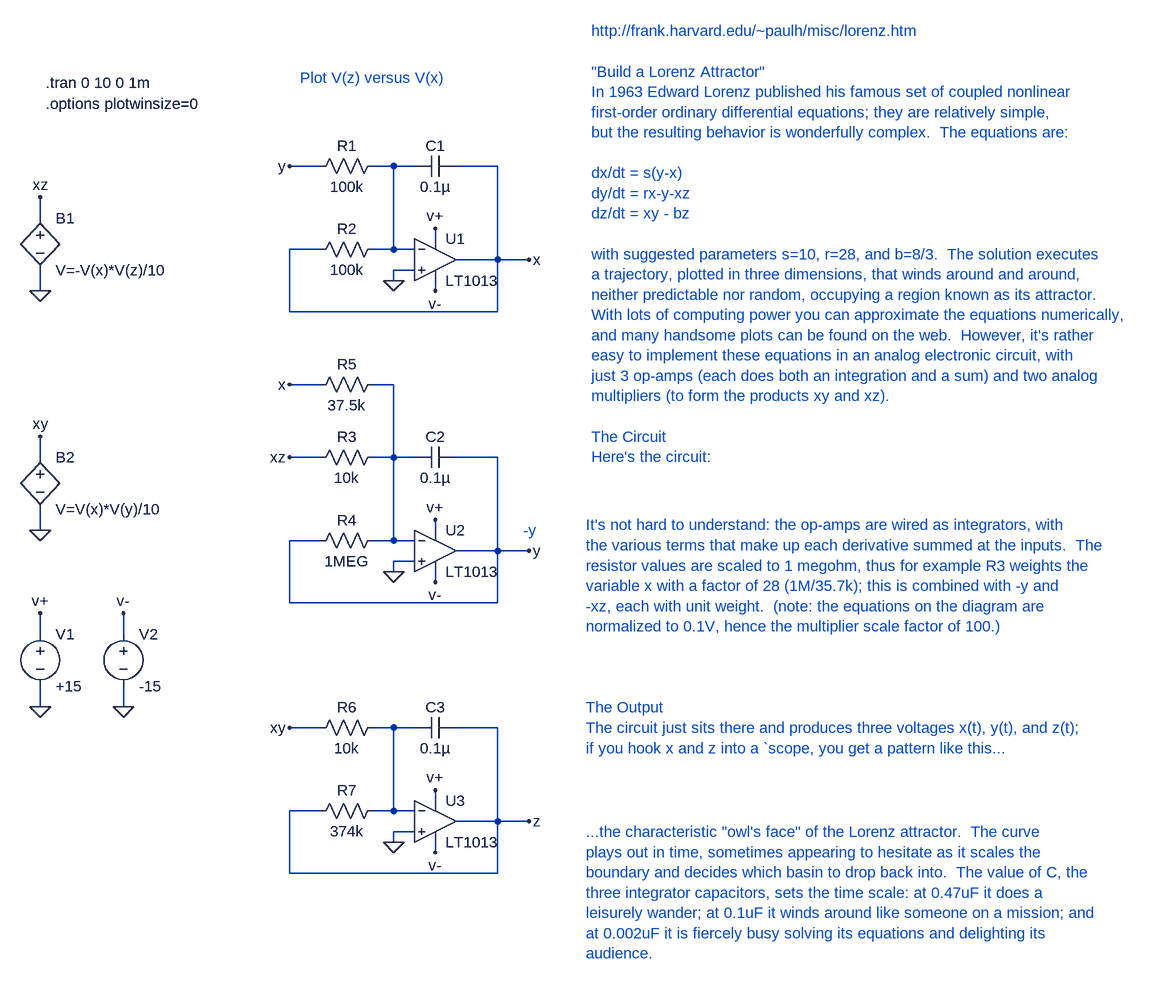
[diagram p0: schematic Lorenz.asc]
Lorenz.asc, the LTspice schematic file:
Version 4
SHEET 1 1476 884
WIRE 272 -368 240 -368
WIRE 240 -368 240 -240
WIRE 240 -368 208 -368
WIRE 240 -240 272 -240
WIRE 240 -240 208 -240
WIRE 336 -368 400 -368
WIRE 400 -368 400 -224
WIRE 400 -224 336 -224
WIRE 400 -224 448 -224
WIRE 272 -208 240 -208
WIRE 240 -208 240 -192
WIRE 304 -256 304 -272
WIRE 304 -192 304 -176
WIRE 400 -224 400 -144
WIRE 400 -144 80 -144
WIRE 80 -144 80 -240
WIRE 80 -240 128 -240
WIRE 128 -368 80 -368
WIRE 272 80 240 80
WIRE 240 80 240 208
WIRE 240 80 208 80
WIRE 240 208 272 208
WIRE 240 208 208 208
WIRE 336 80 400 80
WIRE 400 80 400 224
WIRE 400 224 336 224
WIRE 400 224 448 224
WIRE 272 240 240 240
WIRE 240 240 240 256
WIRE 304 192 304 176
WIRE 304 256 304 272
WIRE 400 224 400 304
WIRE 400 304 80 304
WIRE 80 304 80 208
WIRE 80 208 128 208
WIRE 128 80 80 80
WIRE 240 -32 208 -32
WIRE 128 -32 80 -32
WIRE 240 80 240 -32
WIRE 272 496 240 496
WIRE 240 496 240 624
WIRE 240 496 208 496
WIRE 240 624 272 624
WIRE 240 624 208 624
WIRE 336 496 400 496
WIRE 400 496 400 640
WIRE 400 640 336 640
WIRE 400 640 448 640
WIRE 272 656 240 656
WIRE 240 656 240 672
WIRE 304 608 304 592
WIRE 304 672 304 688
WIRE 400 640 400 720
WIRE 400 720 80 720
WIRE 80 720 80 624
WIRE 80 624 128 624
WIRE 128 496 80 496
WIRE -304 -208 -304 -176
WIRE -304 160 -304 192
WIRE -304 80 -304 48
WIRE -304 -288 -304 -320
WIRE -304 432 -304 464
WIRE -176 432 -176 464
WIRE -304 352 -304 320
WIRE -176 352 -176 320
FLAG 240 -192 0
FLAG 304 -272 v+
FLAG 304 -176 v-
FLAG 240 256 0
FLAG 304 176 v+
FLAG 304 272 v-
FLAG 240 672 0
FLAG 304 592 v+
FLAG 304 688 v-
FLAG 448 -224 x
FLAG 448 224 y
FLAG 448 640 z
FLAG 80 -368 y
FLAG 80 -32 x
FLAG 80 80 xz
FLAG 80 496 xy
FLAG -304 -176 0
FLAG -304 192 0
FLAG -304 -320 xz
FLAG -304 48 xy
FLAG -304 464 0
FLAG -176 464 0
FLAG -304 320 v+
FLAG -176 320 v-
SYMBOL Opamps\\LT1013 304 -288 R0
SYMATTR InstName U1
SYMBOL cap 272 -352 R270
WINDOW 0 32 32 VTop 0
WINDOW 3 0 32 VBottom 0
SYMATTR InstName C1
SYMATTR Value 0.1µ
SYMATTR SpiceLine IC=0
SYMBOL res 112 -352 R270
WINDOW 0 32 56 VTop 0
WINDOW 3 0 56 VBottom 0
SYMATTR InstName R1
SYMATTR Value 100k
SYMBOL res 112 -224 R270
WINDOW 0 32 56 VTop 0
WINDOW 3 0 56 VBottom 0
SYMATTR InstName R2
SYMATTR Value 100k
SYMBOL Opamps\\LT1013 304 160 R0
SYMATTR InstName U2
SYMBOL cap 272 96 R270
WINDOW 0 32 32 VTop 0
WINDOW 3 0 32 VBottom 0
SYMATTR InstName C2
SYMATTR Value 0.1µ
SYMATTR SpiceLine IC=0
SYMBOL res 112 96 R270
WINDOW 0 32 56 VTop 0
WINDOW 3 0 56 VBottom 0
SYMATTR InstName R3
SYMATTR Value 10k
SYMBOL res 112 224 R270
WINDOW 0 32 56 VTop 0
WINDOW 3 0 56 VBottom 0
SYMATTR InstName R4
SYMATTR Value 1MEG
SYMBOL res 112 -16 R270
WINDOW 0 32 56 VTop 0
WINDOW 3 0 56 VBottom 0
SYMATTR InstName R5
SYMATTR Value 37.5k
SYMBOL Opamps\\LT1013 304 576 R0
SYMATTR InstName U3
SYMBOL cap 272 512 R270
WINDOW 0 32 32 VTop 0
WINDOW 3 0 32 VBottom 0
SYMATTR InstName C3
SYMATTR Value 0.1µ
SYMATTR SpiceLine IC=0
SYMBOL res 112 512 R270
WINDOW 0 32 56 VTop 0
WINDOW 3 0 56 VBottom 0
SYMATTR InstName R6
SYMATTR Value 10k
SYMBOL res 112 640 R270
WINDOW 0 32 56 VTop 0
WINDOW 3 0 56 VBottom 0
SYMATTR InstName R7
SYMATTR Value 374k
SYMBOL bv -304 -304 R0
SYMATTR InstName B1
SYMATTR Value V=-V(x)*V(z)/10
SYMBOL bv -304 64 R0
SYMATTR InstName B2
SYMATTR Value V=V(x)*V(y)/10
SYMBOL voltage -304 336 R0
SYMATTR InstName V1
SYMATTR Value +15
SYMBOL voltage -176 336 R0
SYMATTR InstName V2
SYMATTR Value -15
TEXT 440 192 Left 0 ;-y
TEXT -296 -496 Left 0 !.tran 0 10 0 1m
TEXT -296 -464 Left 0 !.options plotwinsize=0
TEXT 544 -576 Left 0 ;http://frank.harvard.edu/~paulh/misc/lorenz.htm\n \n"Build a Lorenz Attractor"\nIn 1963 Edward Lorenz published his famous set of coupled nonlinear\nfirst-order ordinary differential equations; they are relatively simple,\nbut the resulting behavior is wonderfully complex.  The equations are:\n \ndx/dt = s(y-x)\ndy/dt = rx-y-xz\ndz/dt = xy - bz\n \nwith suggested parameters s=10, r=28, and b=8/3.  The solution executes\na trajectory, plotted in three dimensions, that winds around and around,\nneither predictable nor random, occupying a region known as its attractor.\nWith lots of computing power you can approximate the equations numerically,\nand many handsome plots can be found on the web.  However, it's rather\neasy to implement these equations in an analog electronic circuit, with\njust 3 op-amps (each does both an integration and a sum) and two analog\nmultipliers (to form the products xy and xz).\n \nThe Circuit\nHere's the circuit:
TEXT 536 184 Left 0 ;It's not hard to understand: the op-amps are wired as integrators, with\nthe various terms that make up each derivative summed at the inputs.  The\nresistor values are scaled to 1 megohm, thus for example R3 weights the\nvariable x with a factor of 28 (1M/35.7k); this is combined with -y and\n-xz, each with unit weight.  (note: the equations on the diagram are\nnormalized to 0.1V, hence the multiplier scale factor of 100.)\n \n\n \nThe Output\nThe circuit just sits there and produces three voltages x(t), y(t), and z(t);\nif you hook x and z into a `scope, you get a pattern like this...
TEXT 536 656 Left 0 ;...the characteristic "owl's face" of the Lorenz attractor.  The curve\nplays out in time, sometimes appearing to hesitate as it scales the\nboundary and decides which basin to drop back into.  The value of C, the\nthree integrator capacitors, sets the time scale: at 0.47uF it does a\nleisurely wander; at 0.1uF it winds around like someone on a mission; and\nat 0.002uF it is fiercely busy solving its equations and delighting its\naudience.
TEXT 96 -504 Left 0 ;Plot V(z) versus V(x)

The netlist it stands for:
* Lorenz.asc
XU1 0 N001 v+ v- x LT1013  ; pins In+ In- V+ V- OUT
C1 N001 x 0.1µ IC=0
R1 y N001 100k
R2 x N001 100k
XU2 0 N002 v+ v- y LT1013  ; pins In+ In- V+ V- OUT
C2 N002 y 0.1µ IC=0
R3 xz N002 10k
R4 y N002 1MEG
R5 x N002 37.5k
XU3 0 N003 v+ v- z LT1013  ; pins In+ In- V+ V- OUT
C3 N003 z 0.1µ IC=0
R6 xy N003 10k
R7 z N003 374k
B1 xz 0 V=-V(x)*V(z)/10
B2 xy 0 V=V(x)*V(y)/10
V1 v+ 0 +15
V2 v- 0 -15
* -y
.tran 0 10 0 1m
.options plotwinsize=0
* http://frank.harvard.edu/~paulh/misc/lorenz.htm
* "Build a Lorenz Attractor"
* In 1963 Edward Lorenz published his famous set of coupled nonlinear
* first-order ordinary differential equations; they are relatively simple,
* but the resulting behavior is wonderfully complex.  The equations are:
* dx/dt = s(y-x)
* dy/dt = rx-y-xz
* dz/dt = xy - bz
* with suggested parameters s=10, r=28, and b=8/3.  The solution executes
* a trajectory, plotted in three dimensions, that winds around and around,
* neither predictable nor random, occupying a region known as its attractor.
* With lots of computing power you can approximate the equations numerically,
* and many handsome plots can be found on the web.  However, it's rather
* easy to implement these equations in an analog electronic circuit, with
* just 3 op-amps (each does both an integration and a sum) and two analog
* multipliers (to form the products xy and xz).
* The Circuit
* Here's the circuit:
* It's not hard to understand: the op-amps are wired as integrators, with
* the various terms that make up each derivative summed at the inputs.  The
* resistor values are scaled to 1 megohm, thus for example R3 weights the
* variable x with a factor of 28 (1M/35.7k); this is combined with -y and
* -xz, each with unit weight.  (note: the equations on the diagram are
* normalized to 0.1V, hence the multiplier scale factor of 100.)
* The Output
* The circuit just sits there and produces three voltages x(t), y(t), and z(t);
* if you hook x and z into a `scope, you get a pattern like this...
* ...the characteristic "owl's face" of the Lorenz attractor.  The curve
* plays out in time, sometimes appearing to hesitate as it scales the
* boundary and decides which basin to drop back into.  The value of C, the
* three integrator capacitors, sets the time scale: at 0.47uF it does a
* leisurely wander; at 0.1uF it winds around like someone on a mission; and
* at 0.002uF it is fiercely busy solving its equations and delighting its
* audience.
* Plot V(z) versus V(x)
.lib LTC.lib
.backanno
.end